# Altium schematic sheet FPGA扩展板.SchDoc
size A4
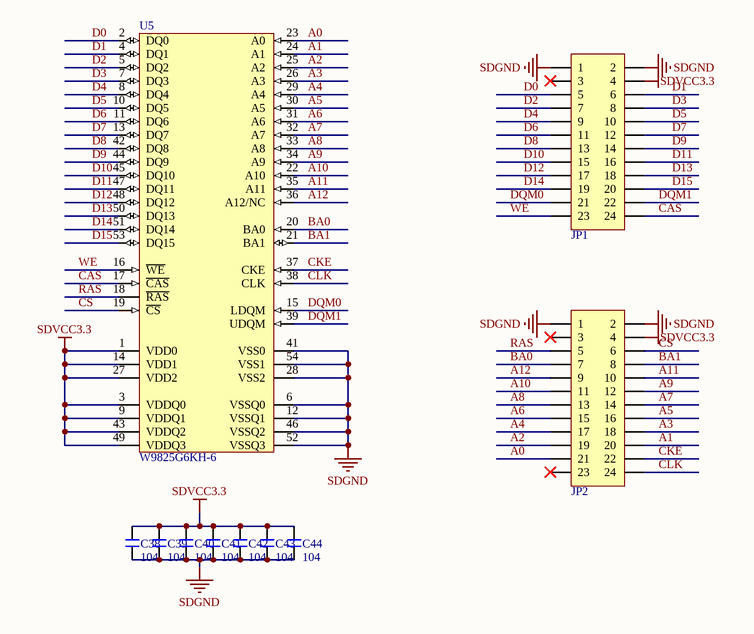
[diagram p0: FPGA扩展板.SchDoc]

## Parts
C38  104  [C 0603_L]
C39  104  [C 0603_L]
C40  104  [C 0603_L]
C41  104  [C 0603_L]
C42  104  [C 0603_L]
C43  104  [C 0603_L]
C44  104  [C 0603_L]
JP1  Header 2X11  [HDR2.54-LI-2x12P]  (value not drawn)
JP2  Header 2X11  [HDR2.54-LI-2x12P]  (value not drawn)
U5  W9825G6KH-6  [TSOP54]

## Nets
SDGND: C38.1 C39.1 C40.1 C41.1 C42.1 C43.1 C44.1 JP1.1 JP1.2 JP2.1 JP2.2 U5.6(VSSQ0) U5.12(VSSQ1) U5.28(VSS2) U5.41(VSS0) U5.46(VSSQ2) U5.52(VSSQ3) U5.54(VSS1)
SDVCC3.3: C38.2 C39.2 C40.2 C41.2 C42.2 C43.2 C44.2 JP1.4 JP2.4 U5.1(VDD0) U5.3(VDDQ0) U5.9(VDDQ1) U5.14(VDD1) U5.27(VDD2) U5.43(VDDQ2) U5.49(VDDQ3)
A0: JP2.21 U5.23(A0)
A1: JP2.20 U5.24(A1)
A2: JP2.19 U5.25(A2)
A3: JP2.18 U5.26(A3)
A4: JP2.17 U5.29(A4)
A5: JP2.16 U5.30(A5)
A6: JP2.15 U5.31(A6)
A7: JP2.14 U5.32(A7)
A8: JP2.13 U5.33(A8)
A9: JP2.12 U5.34(A9)
A10: JP2.11 U5.22(A10)
A11: JP2.10 U5.35(A11)
A12: JP2.9 U5.36(A12/NC)
BA0: JP2.7 U5.20(BA0)
BA1: JP2.8 U5.21(BA1)
CAS: JP1.24 U5.17(~{CAS})
CKE: JP2.22 U5.37(CKE)
CLK: JP2.24 U5.38(CLK)
CS: JP2.6 U5.19(~{CS})
D0: JP1.5 U5.2(DQ0)
D1: JP1.6 U5.4(DQ1)
D2: JP1.7 U5.5(DQ2)
D3: JP1.8 U5.7(DQ3)
D4: JP1.9 U5.8(DQ4)
D5: JP1.10 U5.10(DQ5)
D6: JP1.11 U5.11(DQ6)
D7: JP1.12 U5.13(DQ7)
D8: JP1.13 U5.42(DQ8)
D9: JP1.14 U5.44(DQ9)
D10: JP1.15 U5.45(DQ10)
D11: JP1.16 U5.47(DQ11)
D12: JP1.17 U5.48(DQ12)
D13: JP1.18 U5.50(DQ13)
D14: JP1.19 U5.51(DQ14)
D15: JP1.20 U5.53(DQ15)
DQM0: JP1.21 U5.15(LDQM)
DQM1: JP1.22 U5.39(UDQM)
RAS: JP2.5 U5.18(~{RAS})
WE: JP1.23 U5.16(~{WE})

Not connected (* = marked no-connect by the designer): JP1 3*; JP2 3* 23*

## Library data of the parts
C38-C44 = C: 贴片电容; BOM名称: 无极性贴片电容; 淘宝ID: 封装库来自淘宝 ID：黄晶宝石; 联系售后: https://shop463601444.taobao.com
JP1 JP2 = Header 12X2: 12*2P接插件; 版权归属: 源创客; BOM名称: 12*2P接插件; 学习资源: www.ooocke.com
U5 = IS42S16160B: 32MB SDRAM